# Altium schematic sheet dv_mcu_mpi_driver.SchDoc: =GlobalProjectName
size 209 x 297 mm; ApprovedBy: Утвердил; CheckedBy: Проверил; Author: Разработал; SheetNumber: 5; SheetTotal: 6; PageSetup: Record=PageOptions|CenterHorizontal=True|CenterVertical=True|PrintScale=1.00|XCorrection=1.00|YCorrection=1.00|PrintKind=1|BorderSize=5000000|LeftOffset=0|BottomOffset=0|Orientation=2|PaperLength=1000|PaperWidth=1000|Scale=100|PaperSource=15|PrintQuality=1200|MediaType=1|DitherType=10|PaperKind=A3|PrintScaleMode=1; Weight: -; ScaleFactor: -; NormInspection: Норм.Контр.
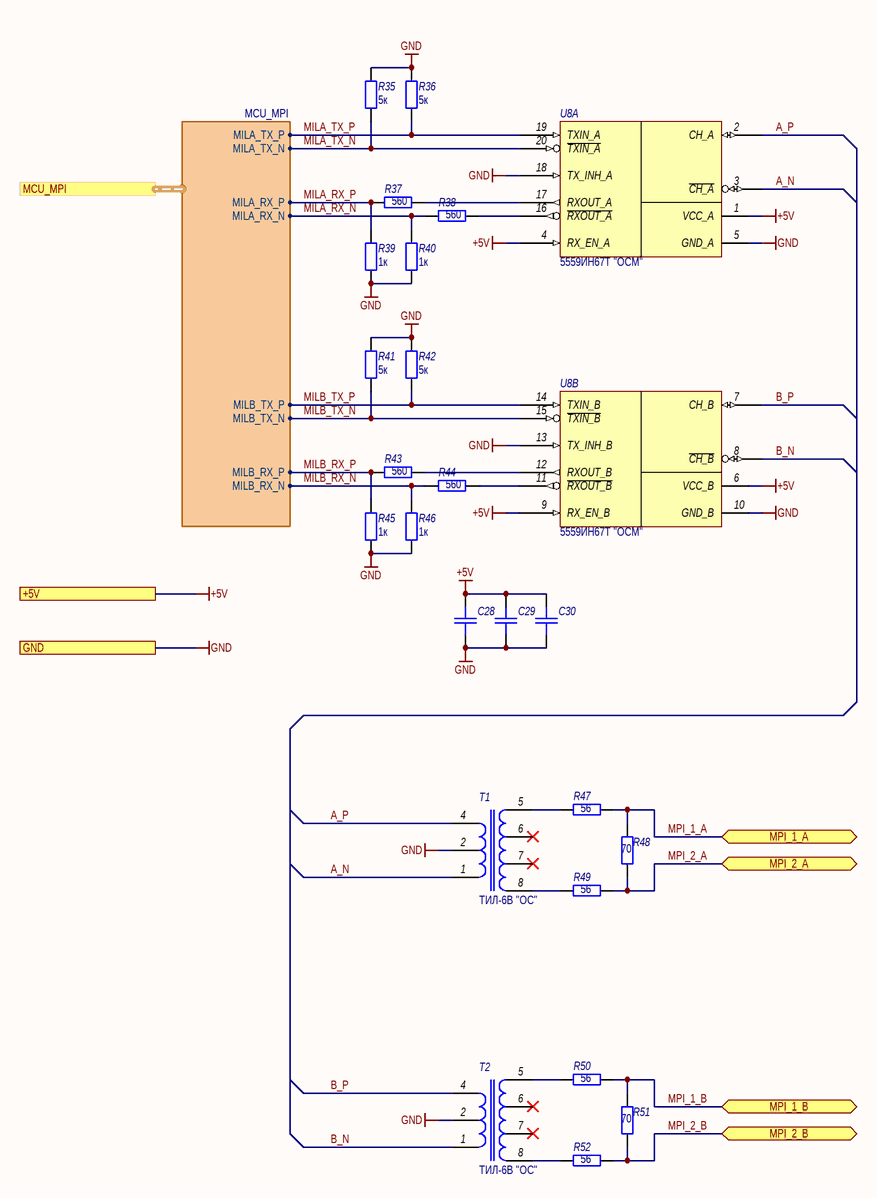
[diagram p0: dv_mcu_mpi_driver.SchDoc]

## Parts
C28  K10-79  [SMD_C0805]  (value not drawn)
C29  K10-79  [SMD_C0805]  (value not drawn)
C30  K10-79  [SMD_C0805]  (value not drawn)
R35  value 5к  [SMD_0805]
R36  value 5к  [SMD_0805]  (hidden comment: OSM R1-12)
R37  value 560  [SMD_0805]  (hidden comment: OSM R1-12)
R38  value 560  [SMD_0805]  (hidden comment: OSM R1-12)
R39  value 1к  [SMD_0805]  (hidden comment: OSM R1-12)
R40  value 1к  [SMD_0805]  (hidden comment: OSM R1-12)
R41  value 5к  [SMD_0805]  (hidden comment: OSM R1-12)
R42  value 5к  [SMD_0805]  (hidden comment: OSM R1-12)
R43  value 560  [SMD_0805]  (hidden comment: OSM R1-12)
R44  value 560  [SMD_0805]  (hidden comment: OSM R1-12)
R45  value 1к  [SMD_0805]  (hidden comment: OSM R1-12)
R46  value 1к  [SMD_0805]  (hidden comment: OSM R1-12)
R47  value 56  [SMD_0805]  (hidden comment: OSM R1-12)
R48  value 70  [SMD_0805]  (hidden comment: OSM R1-12)
R49  value 56  [SMD_0805]  (hidden comment: OSM R1-12)
R50  value 56  [SMD_0805]  (hidden comment: OSM R1-12)
R51  value 70  [SMD_0805]  (hidden comment: OSM R1-12)
R52  value 56  [SMD_0805]  (hidden comment: OSM R1-12)
T1  Наименование: ТИЛ-6В "ОС"  [TIL-6V]  (hidden comment: TIL-6V)
T2  Наименование: ТИЛ-6В "ОС"  [TIL-6V]  (hidden comment: TIL-6V)
U8  Наименование: 5559ИН67Т "ОСМ"  [4153.20-6]  (hidden comment: 5559IN67T_OSM)  (parts A,B of 2)

## Ports
+5V, GND, MCU_MPI (harness MCU_MPI), MPI_1_A (bidir), MPI_1_B (bidir), MPI_2_A (bidir), MPI_2_B (bidir)

## Harnesses
MCU_MPI: MILB_RX_N, MILB_RX_P, MILB_TX_P, MILB_TX_N, MILA_RX_N, MILA_RX_P, MILA_TX_P, MILA_TX_N

## Nets
+5V: C28.2 C29.2 C30.2 U8.1(VCC_A) U8.4(RX_EN_A) U8.6(VCC_B) U8.9(RX_EN_B) ; port +5V
GND: C28.1 C29.1 C30.1 R35.1 R36.1 R39.2 R40.2 R41.1 R42.1 R45.2 R46.2 T1.2 T2.2 U8.5(GND_A) U8.10(GND_B) U8.13(TX_INH_B) U8.18(TX_INH_A) ; port GND
A_N: T1.1 U8.3(~{CH_A})
A_P: T1.4 U8.2(CH_A)
B_N: T2.1 U8.8(~{CH_B})
B_P: T2.4 U8.7(CH_B)
MILA_RX_N: R38.1 R40.1 ; port MCU_MPI.MILA_RX_N
MILA_RX_P: R37.1 R39.1 ; port MCU_MPI.MILA_RX_P
MILA_TX_N: R35.2 U8.20(~{TXIN_A}) ; port MCU_MPI.MILA_TX_N
MILA_TX_P: R36.2 U8.19(TXIN_A) ; port MCU_MPI.MILA_TX_P
MILB_RX_N: R44.1 R46.1 ; port MCU_MPI.MILB_RX_N
MILB_RX_P: R43.1 R45.1 ; port MCU_MPI.MILB_RX_P
MILB_TX_N: R41.2 U8.15(~{TXIN_B}) ; port MCU_MPI.MILB_TX_N
MILB_TX_P: R42.2 U8.14(TXIN_B) ; port MCU_MPI.MILB_TX_P
MPI_1_A: R47.1 R48.1 ; port MPI_1_A
MPI_1_B: R50.1 R51.1 ; port MPI_1_B
MPI_2_A: R48.2 R49.1 ; port MPI_2_A
MPI_2_B: R51.2 R52.1 ; port MPI_2_B
NetR37_2: R37.2 U8.17(RXOUT_A)
NetR38_2: R38.2 U8.16(~{RXOUT_A})
NetR43_2: R43.2 U8.12(RXOUT_B)
NetR44_2: R44.2 U8.11(~{RXOUT_B})
NetR47_2: R47.2 T1.5
NetR49_2: R49.2 T1.8
NetR50_2: R50.2 T2.5
NetR52_2: R52.2 T2.8

Not connected (* = marked no-connect by the designer): T1 6* 7*; T2 6* 7*

## Notes on the sheet
- Подп. и дата
- Инв. № дубл.
- Взам. инв. №
- Инв. № подл.
- Изм.
- Лист
- № докум.
- Подп.
- Дата
- Форма 2а ГОСТ 2.104-2006
- Копировал
- Формат А4

## Library data of the parts
C28 C30 = Capacitor: Назначение: SMD-конденсатор; Наименование: К10-79; Потребление, Вт: 0; Value: 10мкФ; Напряжение: В; Точность: %
C29 = Capacitor: Назначение: SMD-конденсатор; Наименование: К10-79; Потребление, Вт: 0; Value: 0,1мкФ; Напряжение: В; Точность: %
R35-R52 = Resistor: Наименование: ОСМ Р1-12; Назначение: SMD-резистор; Потребление, Вт: 0,001; Точность: %
T1 T2 = TIL-6V: Импульсный трансформатор; Назначение: Импульсный трансформатор МПИ; Потребление, Вт: 0.0
U8 = 5559IN67T: Приемопередатчики манчестерского кода; Назначение: Приемопередатчик манчестерского кода; Потребление, Вт: 0.1; ComponentLink1Description: DataSheet; ComponentLink1URL: https://www.integral.by/sites/default/files/5559_IN67_68T.pdf